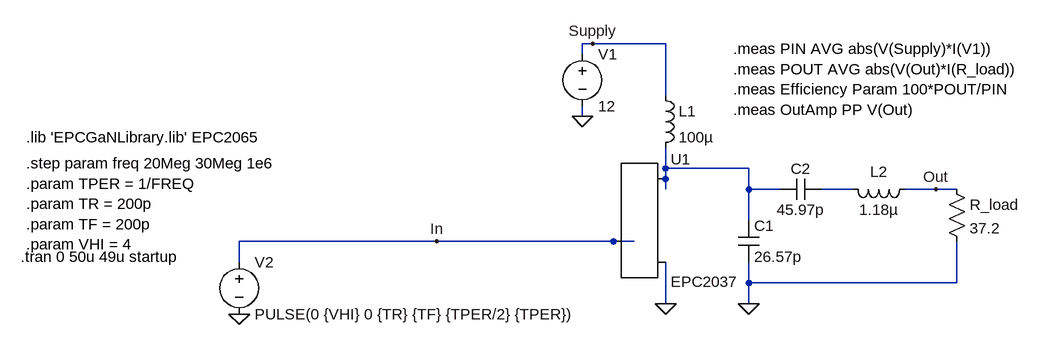
[diagram p0: schematic Class_E_GaN.asc]
Class_E_GaN.asc, the LTspice schematic file:
Version 4.1
SHEET 1 880 800
WIRE 32 -96 16 -96
WIRE 144 -96 32 -96
WIRE 16 -80 16 -96
WIRE 144 -16 144 -96
WIRE 16 16 16 0
WIRE 144 96 144 64
WIRE 272 96 144 96
WIRE 144 112 144 96
WIRE 144 128 144 112
WIRE 272 128 272 96
WIRE 320 128 272 128
WIRE 432 128 384 128
WIRE 560 128 512 128
WIRE 592 128 560 128
WIRE 272 176 272 128
WIRE -208 208 -512 208
WIRE 64 208 -208 208
WIRE 96 208 64 208
WIRE -512 240 -512 208
WIRE 272 272 272 240
WIRE 592 272 592 208
WIRE 592 272 272 272
WIRE 144 304 144 240
WIRE 272 304 272 272
FLAG 16 16 0
FLAG -512 320 0
FLAG 272 304 0
FLAG -208 208 In
FLAG 560 128 Out
FLAG 32 -96 Supply
FLAG 144 304 0
SYMBOL voltage 16 -96 R0
WINDOW 123 0 0 Left 0
WINDOW 39 0 0 Left 0
SYMATTR InstName V1
SYMATTR Value 12
SYMBOL voltage -512 224 R0
WINDOW 123 0 0 Left 0
WINDOW 39 0 0 Left 0
SYMATTR InstName V2
SYMATTR Value PULSE(0 {VHI} 0 {TR} {TF} {TPER/2} {TPER})
SYMBOL ind 128 -32 R0
SYMATTR InstName L1
SYMATTR Value 100µ
SYMBOL cap 256 176 R0
SYMATTR InstName C1
SYMATTR Value 26.57p
SYMBOL cap 384 112 R90
WINDOW 0 0 32 VBottom 2
WINDOW 3 32 32 VTop 2
SYMATTR InstName C2
SYMATTR Value 45.97p
SYMBOL ind 528 112 R90
WINDOW 0 5 56 VBottom 2
WINDOW 3 32 56 VTop 2
SYMATTR InstName L2
SYMATTR Value 1.18µ
SYMBOL res 576 112 R0
SYMATTR InstName R_load
SYMATTR Value 37.2
SYMBOL EPCGaN 64 208 R0
SYMATTR InstName U1
SYMATTR Value EPC2037
TEXT -848 232 Left 2 !.tran 0 50u 49u startup
TEXT -840 88 Left 2 !.step param freq 20Meg 30Meg 1e6\n.param TPER = 1/FREQ\n.param TR = 200p\n.param TF = 200p\n.param VHI = 4
TEXT 248 -88 Left 2 !.meas PIN AVG abs(V(Supply)*I(V1))\n.meas POUT AVG abs(V(Out)*I(R_load))\n.meas Efficiency Param 100*POUT/PIN\n.meas OutAmp PP V(Out)
TEXT -840 48 Left 2 !.lib 'EPCGaNLibrary.lib' EPC2065

The netlist it stands for:
* Class_E_GaN.asc
V1 Supply 0 12
V2 In 0 PULSE(0 {VHI} 0 {TR} {TF} {TPER/2} {TPER})
L1 Supply N001 100µ
C1 N001 0 26.57p
C2 N002 N001 45.97p
L2 Out N002 1.18µ
R_load Out 0 37.2
X§U1 In N001 0 EPC2037
.tran 0 50u 49u startup
.step param freq 20Meg 30Meg 1e6
.param TPER = 1/FREQ
.param TR = 200p
.param TF = 200p
.param VHI = 4
.meas PIN AVG abs(V(Supply)*I(V1))
.meas POUT AVG abs(V(Out)*I(R_load))
.meas Efficiency Param 100*POUT/PIN
.meas OutAmp PP V(Out)
.lib 'EPCGaNLibrary.lib' EPC2065
.backanno
.end